# EasyEDA schematic SCH_PROJET_SAE_2025.json
TITLE: Schematic; REV: 1.0; Date: 2025-09-22; Sheet: 1/1; Drawn By: cawcafr; Company: Your Company
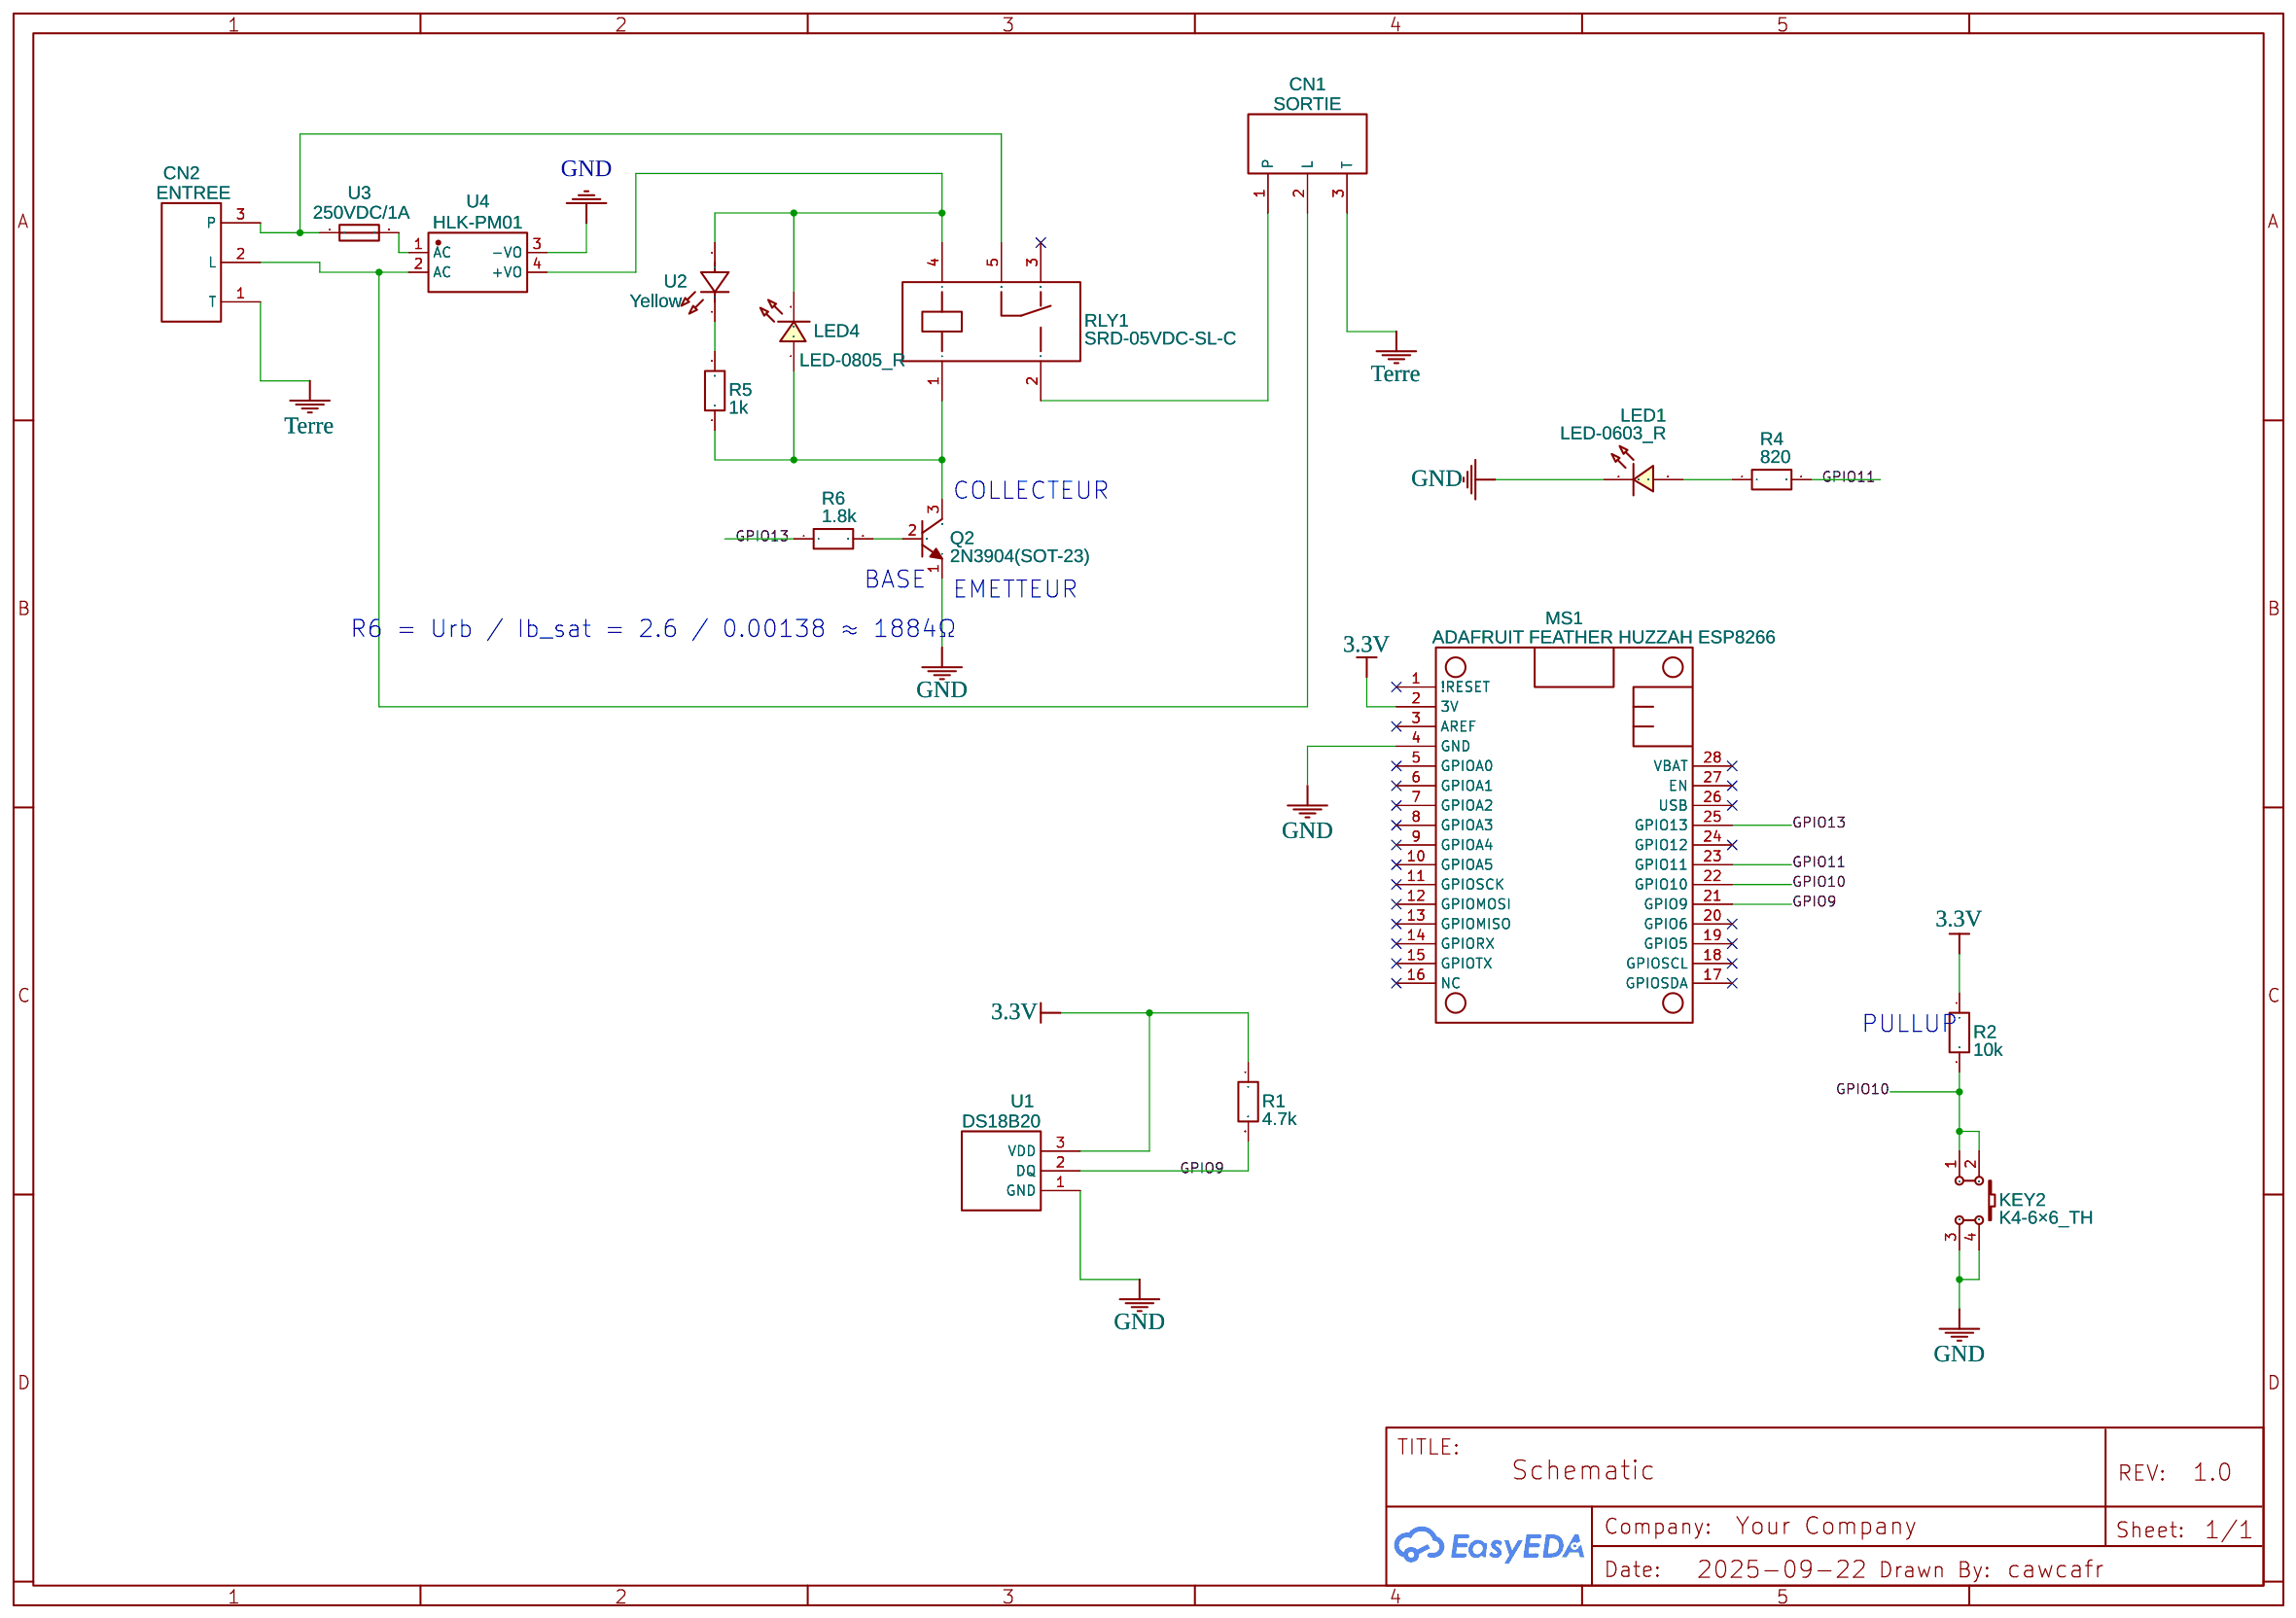
[diagram p0: schematic sheet]

## Parts
CN1  SORTIE  [CONN-TH_3P-P5.08_1729131_V1]
CN2  ENTREE  [CONN-TH_3P-P5.08_1729131_V1]
KEY2  K4-6×6_TH  [SW-TH_4P-L6.0-W6.0-P4.50-LS6.5-H9.0_V1]
LED1  LED-0603_R  [LED-TH-3MM_V1]
LED4  LED-0805_R  [LED-TH-3MM_V1]
MS1  ADAFRUIT FEATHER HUZZAH ESP8266  [ADAFRUIT FEATHER HUZZAH ESP82668V1]
Q2  2N3904(SOT-23)  [TO-92-3_L4.8-W3.2-P2.54-L_BT169H-L01EP_V1]
R1  4.7k  [RES-TH_BD1.9-L3.2-P7.20-D0.5_V1]
R2  10k  [RES-TH_BD1.9-L3.2-P7.20-D0.5_V1]
R4  820  [RES-TH_BD1.9-L3.2-P7.20-D0.5_V1]
R5  1k  [RES-TH_BD1.9-L3.2-P7.20-D0.5_V1]
R6  1.8k  [RES-TH_BD1.9-L3.2-P7.20-D0.5_V1]
RLY1  SRD-05VDC-SL-C  [RELAY-TH_SRD-XXVDC-XL-C_V1]
U1  DS18B20  [DS18B20_V1]
U2  Yellow  [LED-TH-3MM_V1]
U3  250VDC/1A  [FUSE-TH_L13.3-W2.6-P5.25-D0.8_V1]
U4  HLK-PM01  [PWRM-TH_HLK-PM01NBX_V1]

## Library data of the parts
CN1 CN2 = MKDSN1.5/3-5.08: Supplier: LCSC; Manufacturer: Phoenix Contact(菲尼克斯); Manufacturer Part: 1729131; Supplier Part: C91154; JLCPCB Part Class: Extended Part; Package Display: No
KEY2 = K4-6×6_TH: Supplier: LCSC; Supplier Part: C136684; Manufacturer: 韩国韩荣; Manufacturer Part: K2-1102DP-E4SW-04; Contributor: LCEDA_Lib
LED1 = LED-0603_R: Manufacturer: EVERLIGHT(台湾亿光); Manufacturer Part: 19-217/R6C-AL1M2VY/3T; Supplier Part: C72044; Supplier: LCSC; Contributor: LCEDA_01
LED4 = LED-0805_R: Manufacturer: EVERLIGHT(台湾亿光); Manufacturer Part: 17-21SURC/S530-A3/TR8; Supplier Part: C72037; Contributor: LCEDA_Lib
MS1 = ADAFRUIT FEATHER HUZZAH ESP8266: sourceId: 0S0UN5Zhz; Contributor: FabLab LabHidouille
Q2 = 2N3904(SOT-23): Supplier: LCSC; Manufacturer: KEC; Manufacturer Part: 2n3904S-RTK/PS; Supplier Part: C18536; Paste Type: SOT-23; Contributor: LCEDA_Lib; Package Display: No
R1 R2 R4-R6 = R_0805_EU: Contributor: LCEDA_Lib
RLY1 = SRD-05VDC-SL-C: Supplier: LCSC; Manufacturer: 松乐; Supplier Part: C35449; JLCPCB Part Class: Extended Part
U1 = DS18B20: Contributor: cpu76239
U2 = 0603: Contributor: lcsc; Convert to PCB: Yes; Add into BOM: Yes; Supplier: LCSC; Supplier Part: C9900014602; Manufacturer: null; JLCPCB Part Class: Extended Part
U3 = 30VDC/4A: Contributor: lcsc; Supplier: LCSC; Supplier Part: C9900024547; Manufacturer: null; JLCPCB Part Class: Extended Part
U4 = HLK-PM01: Contributor: LCSC; Supplier: LCSC; Supplier Part: C209903; Manufacturer: HI-LINK(海凌科); JLCPCB Part Class: Extended Part

## Nets
3.3V: MS1.2(3V) R1.1 R2.1 U1.3(VDD)
GND: KEY2.3 KEY2.4 LED1.2 MS1.4(GND) Q2.1(E) U1.1(GND) U4.3(-VO)
GPIO9: MS1.21(GPIO9) R1.2 U1.2(DQ)
GPIO10: KEY2.1 KEY2.2 MS1.22(GPIO10) R2.2
GPIO11: MS1.23(GPIO11) R4.2
GPIO13: MS1.25(GPIO13) R6.1
Terre: CN1.3(T) CN2.1(T)
Net-(CN1-1): CN1.1(P) RLY1.2
Net-(CN1-2): CN1.2(L) CN2.2(L) U4.2(AC)
Net-(CN2-3): CN2.3(P) RLY1.5 U3.1
Net-(LED1-1): LED1.1 R4.1
Net-(LED4-1): LED4.1 Q2.3(C) R5.1 RLY1.1
Net-(LED4-2): LED4.2 RLY1.4 U2.2(A) U4.4(+VO)
Net-(Q2-2): Q2.2(B) R6.2
Net-(R5-2): R5.2 U2.1(K)
Net-(U3-2): U3.2 U4.1(AC)

Not connected (* = marked no-connect by the designer): MS1 1(!RESET)* 3(AREF)* 5(GPIOA0)* 6(GPIOA1)* 7(GPIOA2)* 8(GPIOA3)* 9(GPIOA4)* 10(GPIOA5)* 11(GPIOSCK)* 12(GPIOMOSI)* 13(GPIOMISO)* 14(GPIORX)* 15(GPIOTX)* 16(NC)* 17(GPIOSDA)* 18(GPIOSCL)* 19(GPIO5)* 20(GPIO6)* 24(GPIO12)* 26(USB)* 27(EN)* 28(VBAT)*; RLY1 3*

## Notes on the sheet
- COLLECTEUR
- BASE
- EMETTEUR
- R6 = Urb / Ib_sat = 2.6 / 0.00138 ≈ 1884Ω
- PULLUP
